# EAGLE schematic elevationsrotor-prinzip (EAGLE 6.5.0)
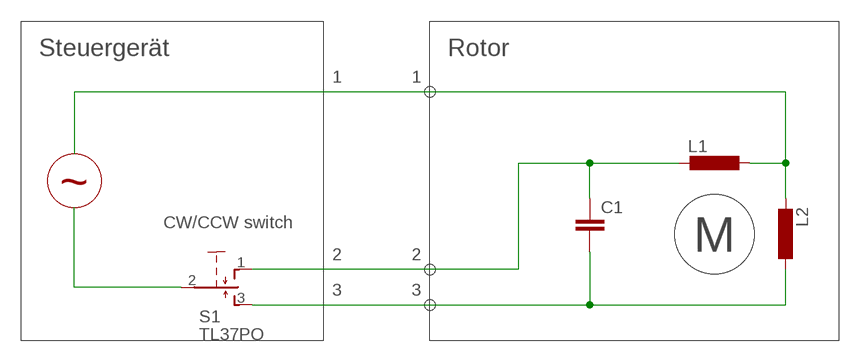
[diagram p0: schematic, sheet 1]

## Parts
C1  C-EU025-040X050  [C025-040X050]
L1  L-EUL1812  [L1812]
L2  L-EUL1812  [L1812]
S1  TL37PO  [TL3XPO]

## Nets
N$1: S1.2(P)
N$3: C1.1 L1.2 S1.1(O)
N$4: C1.2 L2.1 S1.3(S)
N$5: L1.1 L2.2

## Notes on the sheet
- Steuergerät | Rotor
- 1 | 1
- ~
- CW/CCW switch
- M
- 2 | 2
- 3 | 3

## Library data of the parts
C1 = rcl:C-EU: CAPACITOR, European symbol
L1 L2 = rcl:L-EU: INDUCTOR, European symbol
S1 = switch:TL37PO: TINY SWITCH MOM OFF MOM Source: http://www2.produktinfo.conrad.com/datenblaetter/700000-724999/705152-da-01-de-Subminiaturschalter_TL_36YO.pdf